# Altium schematic sheet LowFreqSignal_V2.SchDoc: Low Freq Signal
size A4; DocumentNumber: 5; SheetNumber: 5; SheetTotal: 8
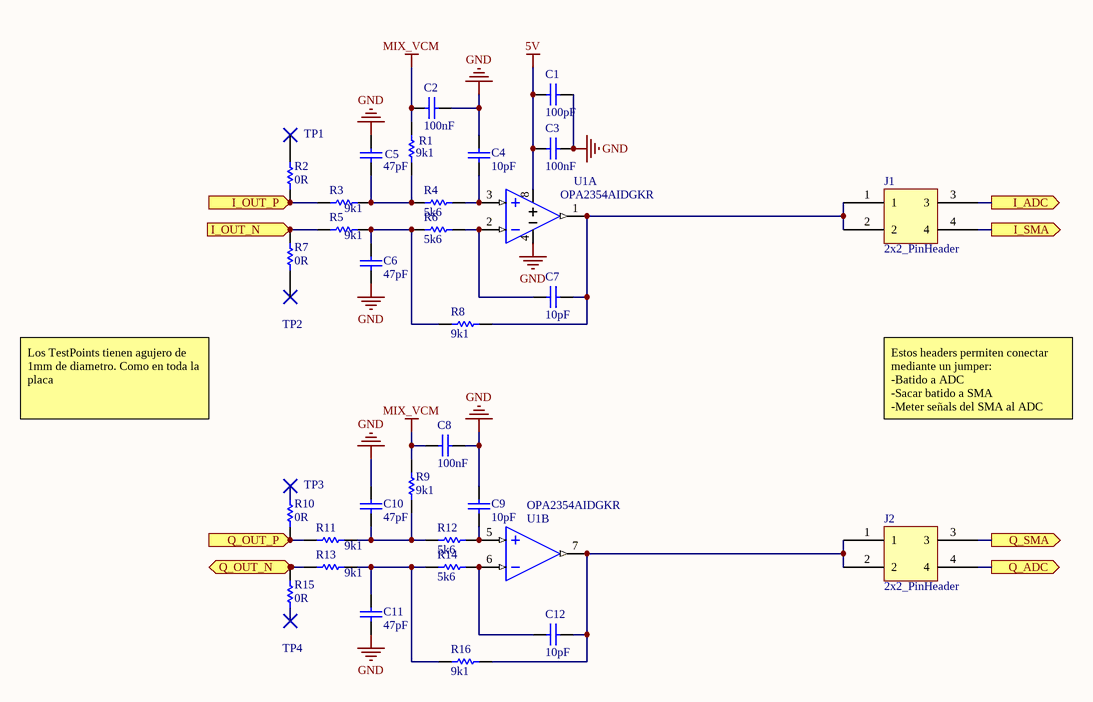
[diagram p0: LowFreqSignal_V2.SchDoc]

## Parts
C1  100pF  [0603 Cap]
C2  100nF  [0603 Cap]
C3  100nF  [0603 Cap]
C4  10pF  [0603 Cap]
C5  47pF  [0603 Cap]
C6  47pF  [0603 Cap]
C7  10pF  [0603 Cap]
C8  100nF  [0603 Cap]
C9  10pF  [0603 Cap]
C10  47pF  [0603 Cap]
C11  47pF  [0603 Cap]
C12  10pF  [0603 Cap]
J1  2x2_PinHeader  [2x2_PinHeader]
J2  2x2_PinHeader  [2x2_PinHeader]
R1  9k1  [0603 Res]
R2  0R  [0603 Res]
R3  9k1  [0603 Res]
R4  5k6  [0603 Res]
R5  9k1  [0603 Res]
R6  5k6  [0603 Res]
R7  0R  [0603 Res]
R8  9k1  [0603 Res]
R9  9k1  [0603 Res]
R10  0R  [0603 Res]
R11  9k1  [0603 Res]
R12  5k6  [0603 Res]
R13  9k1  [0603 Res]
R14  5k6  [0603 Res]
R15  0R  [0603 Res]
R16  9k1  [0603 Res]
TP1  TEST_POINT_PIN  [TESTPOINT]  (value not drawn)  (no BOM)
TP2  TEST_POINT_PIN  [TESTPOINT]  (value not drawn)  (no BOM)
TP3  TEST_POINT_PIN  [TESTPOINT]  (value not drawn)  (no BOM)
TP4  TEST_POINT_PIN  [TESTPOINT]  (value not drawn)  (no BOM)
U1  OPA2354AIDGKR  [MSOP-8]  (parts A,B of 2)

## Ports
I_ADC (out), I_OUT_N (in), I_OUT_P (in), I_SMA (out), Q_ADC (out), Q_OUT_N (in), Q_OUT_P (in), Q_SMA (out)

## Nets
5V: C1.1 C3.1 U1.8(V+)
GND: C1.2 C2.2 C3.2 C4.2 C5.2 C6.1 C8.2 C9.2 C10.2 C11.1 U1.4(V-)
MIX_VCM: C2.1 C8.1 R1.1 R9.1
I_ADC: J1.3 ; port I_ADC
I_OUT_N: R5.2 R7.2 ; port I_OUT_N
I_OUT_P: R2.2 R3.1 ; port I_OUT_P
I_SMA: J1.4 ; port I_SMA
Q_ADC: J2.4 ; port Q_ADC
Q_OUT_N: R13.2 R15.2 ; port Q_OUT_N
Q_OUT_P: R10.2 R11.2 ; port Q_OUT_P
Q_SMA: J2.3 ; port Q_SMA
NetC4_1: C4.1 R4.1 U1.3(IN+A)
NetC5_1: C5.1 R1.2 R3.2 R4.2
NetC6_2: C6.2 R5.1 R6.2 R8.2
NetC7_1: C7.1 R6.1 U1.2(IN-A)
NetC7_2: C7.2 J1.1 J1.2 R8.1 U1.1(OUTA)
NetC9_1: C9.1 R12.1 U1.5(IN+B)
NetC10_1: C10.1 R9.2 R11.1 R12.2
NetC11_2: C11.2 R13.1 R14.2 R16.2
NetC12_1: C12.1 R14.1 U1.6(IN-B)
NetC12_2: C12.2 J2.1 J2.2 R16.1 U1.7(OUTB)
NetR2_1: R2.1 TP1.1
NetR7_1: R7.1 TP2.1
NetR10_1: R10.1 TP3.1
NetR15_1: R15.1 TP4.1

## Notes on the sheet
- Los TestPoints tienen agujero de 1mm de diametro. Como en toda la placa
- Estos headers permiten conectar mediante un jumper:
  -Batido a ADC
  -Sacar batido a SMA
  -Meter señals del SMA al ADC
- Title
- Size:
- A4
- Number:
- Revision:
- Date:
- Sheet
- of

## Library data of the parts
C1 = CL10B101KB8NNNC: CAP CER 100PF 50V X7R 0603; Manufacturer: Samsung Electro-Mechanics America, Inc.; Tolerance: ±10%; Supplier 1: Digi-Key; Manufacturer Part Number: CL10B101KB8NNNC; RoHS: RoHS Compliant; Category: Capacitors; Stock 1: 270807; Pricing 1: 1=0.08, 10=0.026, 100=0.0116, 500=0.00832, 1000=0.00653 (EUR); Packaging: Cut Tape (CT); Part Status: Active; Voltage - Rated: 50V; Temperature Coefficient: X7R; Operating Temperature: -55°C ~ 125°C; Features: -; Ratings: -; Applications: General Purpose; Mounting Type: Surface Mount, MLCC; Package / Case: 0603 (1608 Metric); Size / Dimension: 0.063" L x 0.032" W (1.60mm x 0.80mm); Height - Seated (Max): -; Thickness (Max): 0.035" (0.90mm); Lead Spacing: -; Lead Style: -; ComponentLink1URL: http://media.digikey.com/pdf/Data%20Sheets/Samsung%20PDFs/CL_Series_MLCC_ds.pdf; ComponentLink1Description: http://media.digikey.com/pdf/Data%20Sheets/Samsung%20PDFs/CL_Series_MLCC_ds.pdf; Supplier Part Number 1: 1276-1909-1-ND
C2 C3 C8 = C0603C104K4RACTU: CAP CER 0.1UF 16V X7R 0603; Manufacturer: KEMET; Capacitance: 0.1µF; Tolerance: ±10%; Supplier 1: Digi-Key; Manufacturer Part Number: C0603C104K4RACTU; RoHS: RoHS Compliant; Category: Capacitors; Stock 1: 4491346; Pricing 1: 1=0.09, 10=0.022, 25=0.016, 50=0.0122, 100=0.01, 250=0.00836, 500=0.0071, 1000=0.00559 (EUR); Packaging: Digi-Reel®; Part Status: Active; Voltage - Rated: 16V; Temperature Coefficient: X7R; Operating Temperature: -55°C ~ 125°C; Features: -; Ratings: -; Applications: General Purpose; Failure Rate: -; Mounting Type: Surface Mount, MLCC; Package / Case: 0603 (1608 Metric); Size / Dimension: 0.063" L x 0.031" W (1.60mm x 0.80mm); Height - Seated (Max): -; Thickness (Max): 0.034" (0.87mm); Lead Spacing: -; Lead Style: -; ComponentLink1URL: http://www.kemet.com/docfinder?Partnumber=C0603C104K4RACTU; ComponentLink1Description: http://www.kemet.com/docfinder?Partnumber=C0603C104K4RACTU; Supplier Part Number 1: 399-1096-6-ND
C4-C7 C9-C12 = C_0603: CAP CER 16V X7R 0603; Tolerance: 10; Voltage Rating: 16; Material: Ceramic; Mount: Surface Mount; Case/Package: 0603; Case Code (Metric): 1608; Case Code (Imperial): 0603; Capacitance: *; Dielectric: X7R; Voltage Rating (DC): 16; Termination: SMD; Composition: Ceramic; Voltage: 16; Length: 1.6; Height: 0.8; Width: 0.8; Thickness: 0.035; Depth: 0.8
R1-R16 = R_0603: SMD Resistor, 1%, 0.1W, 0603; Tolerance: 1; Power Rating: 100; Mount: Surface Mount; Case/Package: 0603; Pins: 2; Case Code (Imperial): 0603; Case Code (Metric): 1608; Termination: SMD; Length: 1.6; Height: 0.45; Width: 0.8; Depth: 0.8
TP1-TP4 = TEST_POINT_PIN: Test point for single pin
U1 = OPA2354AIDGKR: IC OPAMP VFB 100MHZ RRO 8VSSOP; Manufacturer: Texas Instruments; Amplifier Type: Voltage Feedback; Output Type: Rail-to-Rail; Slew Rate: 150 V/µs; -3db Bandwidth: 250MHz; Current - Supply: 4.9mA; Voltage - Supply, Single/Dual (±): 2.5 V ~ 5.5 V, ±1.25 V ~ 2.75 V; Supplier 1: Digi-Key; Manufacturer Part Number: OPA2354AIDGKR; RoHS: RoHS Compliant; Category: Integrated Circuits (ICs); Stock 1: 5751; Pricing 1: 1=2.24, 10=2.013, 100=1.6494, 500=1.4041, 1000=1.18418 (EUR); Packaging: Cut Tape (CT); Part Status: Active; Operating Temperature: -40°C ~ 125°C; Mounting Type: Surface Mount; Package / Case: 8-TSSOP, 8-MSOP (0.118", 3.00mm Width); Supplier Device Package: 8-VSSOP; ComponentLink1URL: http://www.ti.com/lit/ds/symlink/opa354.pdf; ComponentLink1Description: http://www.ti.com/lit/ds/symlink/opa354.pdf; Supplier Part Number 1: 296-12642-1-ND